# EAGLE schematic led_controller (EAGLE 7.2.0)
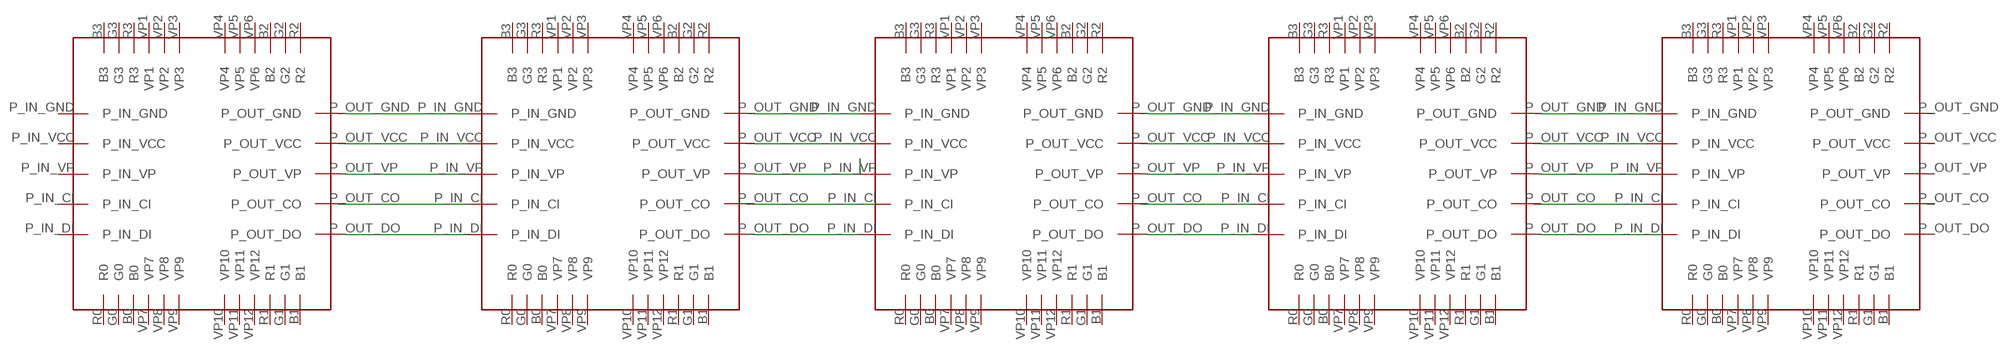
[diagram p0: schematic, sheet 1]

## Parts
U$1  TLC59711_BREAKOUT  [TLC59711_BREAKOUT]
U$2  TLC59711_BREAKOUT  [TLC59711_BREAKOUT]
U$3  TLC59711_BREAKOUT  [TLC59711_BREAKOUT]
U$4  TLC59711_BREAKOUT  [TLC59711_BREAKOUT]
U$5  TLC59711_BREAKOUT  [TLC59711_BREAKOUT]

## Nets
N$1: U$1.P_OUT_GND U$2.P_IN_GND
N$2: U$1.P_OUT_VCC U$2.P_IN_VCC
N$3: U$1.P_OUT_VP U$2.P_IN_VP
N$4: U$1.P_OUT_CO U$2.P_IN_CI
N$5: U$1.P_OUT_DO U$2.P_IN_DI
N$6: U$2.P_OUT_GND U$3.P_IN_GND
N$7: U$2.P_OUT_VCC U$3.P_IN_VCC
N$8: U$2.P_OUT_VP
N$9: U$2.P_OUT_CO
N$10: U$2.P_OUT_DO U$3.P_IN_DI
N$11: U$3.P_OUT_GND U$4.P_IN_GND
N$12: U$3.P_OUT_VCC U$4.P_IN_VCC
N$13: U$3.P_OUT_VP U$4.P_IN_VP
N$14: U$3.P_OUT_CO U$4.P_IN_CI
N$15: U$3.P_OUT_DO U$4.P_IN_DI
N$16: U$4.P_OUT_GND U$5.P_IN_GND
N$17: U$4.P_OUT_VCC U$5.P_IN_VCC
N$18: U$4.P_OUT_VP U$5.P_IN_VP
N$19: U$4.P_OUT_CO U$5.P_IN_CI
N$20: U$4.P_OUT_DO
Unconnected: U$1.B0 U$1.B1 U$1.B2 U$1.B3 U$1.G0 U$1.G1 U$1.G2 U$1.G3 U$1.P_IN_CI U$1.P_IN_DI U$1.P_IN_GND U$1.P_IN_VCC U$1.P_IN_VP U$1.R0 U$1.R1 U$1.R2 U$1.R3 U$1.VP1 U$1.VP2 U$1.VP3 U$1.VP4 U$1.VP5 U$1.VP6 U$1.VP7 U$1.VP8 U$1.VP9 U$1.VP10 U$1.VP11 U$1.VP12 U$2.B0 U$2.B1 U$2.B2 U$2.B3 U$2.G0 U$2.G1 U$2.G2 U$2.G3 U$2.R0 U$2.R1 U$2.R2 U$2.R3 U$2.VP1 U$2.VP2 U$2.VP3 U$2.VP4 U$2.VP5 U$2.VP6 U$2.VP7 U$2.VP8 U$2.VP9 U$2.VP10 U$2.VP11 U$2.VP12 U$3.B0 U$3.B1 U$3.B2 U$3.B3 U$3.G0 U$3.G1 U$3.G2 U$3.G3 U$3.P_IN_CI U$3.P_IN_VP U$3.R0 U$3.R1 U$3.R2 U$3.R3 U$3.VP1 U$3.VP2 U$3.VP3 U$3.VP4 U$3.VP5 U$3.VP6 U$3.VP7 U$3.VP8 U$3.VP9 U$3.VP10 U$3.VP11 U$3.VP12 U$4.B0 U$4.B1 U$4.B2 U$4.B3 U$4.G0 U$4.G1 U$4.G2 U$4.G3 U$4.R0 U$4.R1 U$4.R2 U$4.R3 U$4.VP1 U$4.VP2 U$4.VP3 U$4.VP4 U$4.VP5 U$4.VP6 U$4.VP7 U$4.VP8 U$4.VP9 U$4.VP10 U$4.VP11 U$4.VP12 U$5.B0 U$5.B1 U$5.B2 U$5.B3 U$5.G0 U$5.G1 U$5.G2 U$5.G3 U$5.P_IN_DI U$5.P_OUT_CO U$5.P_OUT_DO U$5.P_OUT_GND U$5.P_OUT_VCC U$5.P_OUT_VP U$5.R0 U$5.R1 U$5.R2 U$5.R3 U$5.VP1 U$5.VP2 U$5.VP3 U$5.VP4 U$5.VP5 U$5.VP6 U$5.VP7 U$5.VP8 U$5.VP9 U$5.VP10 U$5.VP11 U$5.VP12

## Library data of the parts
U$1-U$5 = Andrews:TLC59711_BREAKOUT: Adafruit TLC59711 breakout board footprint